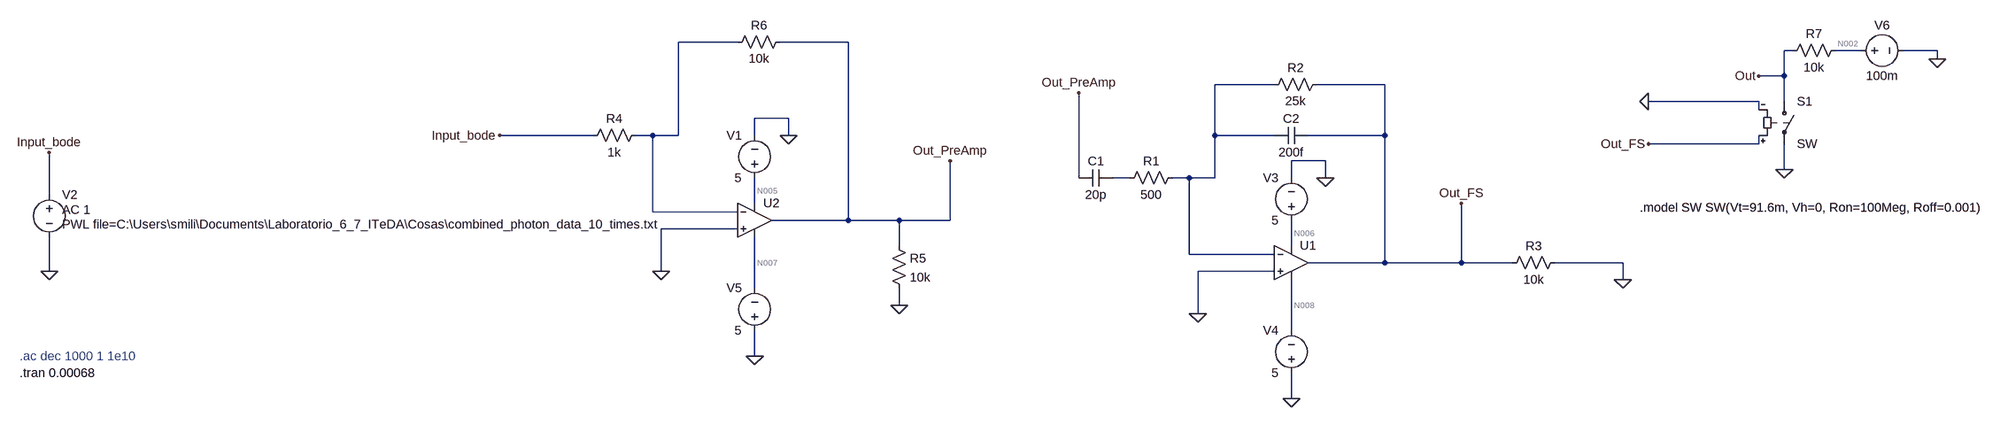
[diagram p0: schematic bode_circuito_completo_sin_capacitirores_en_preamp.asc]
bode_circuito_completo_sin_capacitirores_en_preamp.asc, the LTspice schematic file:
Version 4
SHEET 1 2516 1220
WIRE -768 -544 -880 -544
WIRE -560 -544 -688 -544
WIRE 1360 -528 1344 -528
WIRE 1488 -528 1440 -528
WIRE 1632 -528 1568 -528
WIRE 1632 -512 1632 -528
WIRE 1344 -480 1344 -528
WIRE 1344 -480 1296 -480
WIRE 384 -464 272 -464
WIRE 592 -464 464 -464
WIRE 1296 -432 1088 -432
WIRE 1344 -432 1344 -480
WIRE 1296 -416 1296 -432
WIRE -672 -400 -736 -400
WIRE -1040 -368 -1216 -368
WIRE -928 -368 -960 -368
WIRE -880 -368 -880 -544
WIRE -880 -368 -928 -368
WIRE -736 -368 -736 -400
WIRE -672 -368 -672 -400
WIRE 272 -368 272 -464
WIRE 384 -368 272 -368
WIRE 592 -368 592 -464
WIRE 592 -368 448 -368
WIRE 1296 -352 1296 -368
WIRE 1296 -352 1088 -352
WIRE 480 -320 416 -320
WIRE 1344 -304 1344 -352
WIRE 16 -288 16 -448
WIRE 112 -288 80 -288
WIRE 224 -288 192 -288
WIRE 272 -288 272 -368
WIRE 272 -288 224 -288
WIRE 416 -288 416 -320
WIRE 480 -288 480 -320
WIRE -2064 -256 -2064 -336
WIRE -736 -240 -736 -288
WIRE -928 -224 -928 -368
WIRE -768 -224 -928 -224
WIRE -560 -208 -560 -544
WIRE -560 -208 -704 -208
WIRE -464 -208 -560 -208
WIRE -368 -208 -368 -320
WIRE -368 -208 -464 -208
WIRE -768 -192 -912 -192
WIRE -464 -160 -464 -208
WIRE 416 -160 416 -208
WIRE 224 -144 224 -288
WIRE 384 -144 224 -144
WIRE 592 -128 592 -368
WIRE 592 -128 448 -128
WIRE 736 -128 736 -240
WIRE 736 -128 592 -128
WIRE 832 -128 736 -128
WIRE 1040 -128 912 -128
WIRE -2064 -112 -2064 -176
WIRE -912 -112 -912 -192
WIRE 384 -112 240 -112
WIRE 1040 -96 1040 -128
WIRE -736 -80 -736 -176
WIRE -464 -48 -464 -80
WIRE 240 -32 240 -112
WIRE 416 0 416 -96
WIRE -736 48 -736 0
WIRE 416 128 416 80
FLAG 416 128 0
FLAG 480 -288 0
FLAG 240 -32 0
FLAG 736 -240 Out_FS
FLAG 1040 -96 0
FLAG 16 -448 Out_PreAmp
FLAG -2064 -112 0
FLAG -2064 -336 Input_bode
FLAG -736 48 0
FLAG -672 -368 0
FLAG -912 -112 0
FLAG -368 -320 Out_PreAmp
FLAG -1216 -368 Input_bode
FLAG -464 -48 0
FLAG 1344 -304 0
FLAG 1632 -512 0
FLAG 1296 -480 Out
FLAG 1088 -432 0
FLAG 1088 -352 Out_FS
SYMBOL res 208 -304 R90
WINDOW 0 0 56 VBottom 2
WINDOW 3 32 56 VTop 2
SYMATTR InstName R1
SYMATTR Value 500
SYMBOL res 480 -480 R90
WINDOW 0 0 56 VBottom 2
WINDOW 3 32 56 VTop 2
SYMATTR InstName R2
SYMATTR Value 25k
SYMBOL voltage 416 -192 R180
WINDOW 0 24 96 Left 2
WINDOW 3 24 16 Left 2
WINDOW 123 0 0 Left 0
WINDOW 39 0 0 Left 0
SYMATTR InstName V3
SYMATTR Value 5
SYMBOL voltage 416 96 R180
WINDOW 0 24 96 Left 2
WINDOW 3 24 16 Left 2
WINDOW 123 0 0 Left 0
WINDOW 39 0 0 Left 0
SYMATTR InstName V4
SYMATTR Value 5
SYMBOL OpAmps\\UniversalOpAmp1 416 -128 R0
SYMATTR InstName U1
SYMATTR Value2 Avol=1Meg GBW=800Meg Vos=0
SYMBOL res 928 -144 R90
WINDOW 0 0 56 VBottom 2
WINDOW 3 32 56 VTop 2
SYMATTR InstName R3
SYMATTR Value 10k
SYMBOL cap 80 -304 R90
WINDOW 0 0 32 VBottom 2
WINDOW 3 32 32 VTop 2
SYMATTR InstName C1
SYMATTR Value 20p
SYMBOL cap 448 -384 R90
WINDOW 0 0 32 VBottom 2
WINDOW 3 32 32 VTop 2
SYMATTR InstName C2
SYMATTR Value 200f
SYMBOL res -944 -384 R90
WINDOW 0 0 56 VBottom 2
WINDOW 3 32 56 VTop 2
SYMATTR InstName R4
SYMATTR Value 1k
SYMBOL voltage -736 -272 R180
WINDOW 0 24 96 Left 2
WINDOW 3 24 16 Left 2
WINDOW 123 0 0 Left 0
WINDOW 39 0 0 Left 0
SYMATTR InstName V1
SYMATTR Value 5
SYMBOL voltage -736 16 R180
WINDOW 0 24 96 Left 2
WINDOW 3 24 16 Left 2
WINDOW 123 0 0 Left 0
WINDOW 39 0 0 Left 0
SYMATTR InstName V5
SYMATTR Value 5
SYMBOL OpAmps\\UniversalOpAmp1 -736 -208 R0
SYMATTR InstName U2
SYMATTR Value2 Avol=1Meg GBW=100Meg Vos=0
SYMBOL res -480 -176 R0
SYMATTR InstName R5
SYMATTR Value 10k
SYMBOL res -672 -560 R90
WINDOW 0 0 56 VBottom 2
WINDOW 3 32 56 VTop 2
SYMATTR InstName R6
SYMATTR Value 10k
SYMBOL voltage -2064 -272 R0
WINDOW 123 24 44 Left 2
WINDOW 39 0 0 Left 0
WINDOW 3 24 72 Left 2
SYMATTR Value2 AC 1
SYMATTR InstName V2
SYMATTR Value PWL file=C:\Users\smili\Documents\Laboratorio_6_7_ITeDA\Cosas\combined_photon_data_10_times.txt
SYMBOL sw 1344 -448 R0
SYMATTR InstName S1
SYMBOL voltage 1472 -528 R270
WINDOW 0 32 56 VTop 2
WINDOW 3 -32 56 VBottom 2
WINDOW 123 0 0 Left 0
WINDOW 39 0 0 Left 0
SYMATTR InstName V6
SYMATTR Value 100m
SYMBOL res 1456 -544 R90
WINDOW 0 0 56 VBottom 2
WINDOW 3 32 56 VTop 2
SYMATTR InstName R7
SYMATTR Value 10k
TEXT -2120 80 Left 2 !.tran 0.00068
TEXT -2120 48 Left 2 ;.ac dec 1000 1 1e10
TEXT 1072 -232 Left 2 !.model SW SW(Vt=91.6m, Vh=0, Ron=100Meg, Roff=0.001)

The netlist it stands for:
* bode_circuito_completo_sin_capacitirores_en_preamp.asc
R1 N003 N004 500
R2 Out_FS N003 25k
V3 N006 0 5
V4 0 N008 5
XU1 0 N003 N006 N008 Out_FS level1 Avol=1Meg GBW=800Meg Vos=0 En=0 Enk=0 In=0 Ink=0 Rin=500Meg  ; pins In+ In- V+ V- OUT
R3 0 Out_FS 10k
C1 N004 Out_PreAmp 20p
C2 Out_FS N003 200f
R4 N001 Input_bode 1k
V1 N005 0 5
V5 0 N007 5
XU2 0 N001 N005 N007 Out_PreAmp level1 Avol=1Meg GBW=100Meg Vos=0 En=0 Enk=0 In=0 Ink=0 Rin=500Meg  ; pins In+ In- V+ V- OUT
R5 Out_PreAmp 0 10k
R6 Out_PreAmp N001 10k
V2 Input_bode 0 PWL file=C:\Users\smili\Documents\Laboratorio_6_7_ITeDA\Cosas\combined_photon_data_10_times.txt AC 1
S1 Out 0 Out_FS 0 SW
V6 N002 0 100m
R7 N002 Out 10k
.tran 0.00068
* .ac dec 1000 1 1e10
.model SW SW(Vt=91.6m, Vh=0, Ron=100Meg, Roff=0.001)
.lib UniversalOpAmp1.lib
.backanno
.end

* Results of the author's LTspice run, read from the files saved beside the schematic
* Operating Point, zero values left out:
*   V(n006) = 5 V
*   V(n008) = -5 V
*   V(n005) = 5 V
*   V(n007) = -5 V
*   V(out) = 10 nV
*   V(n002) = 100 mV
*   I(R7) = 10 µA
*   I(S1) = -10 µA
*   I(V3) = -10 nA
*   I(V4) = -10 nA
*   I(V1) = -10 nA
*   I(V5) = -10 nA
*   I(V6) = -10 µA
*   Ix(u1:3) = 10 nA
*   Ix(u1:4) = -10 nA
*   Ix(u2:3) = 10 nA
*   Ix(u2:4) = -10 nA